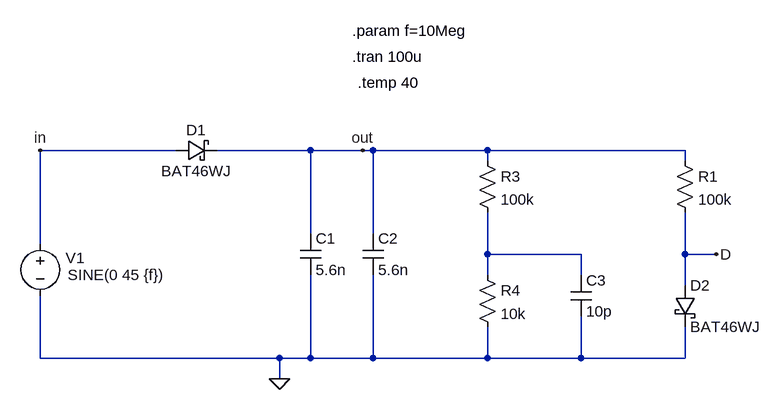
[diagram p0: schematic peak_detector_diode_comp.asc]
peak_detector_diode_comp.asc, the LTspice schematic file:
Version 4
SHEET 1 1120 680
WIRE 96 48 -112 48
WIRE 304 48 160 48
WIRE 384 48 304 48
WIRE 400 48 384 48
WIRE 576 48 400 48
WIRE 880 48 576 48
WIRE 576 64 576 48
WIRE 880 64 880 48
WIRE 304 176 304 48
WIRE 400 176 400 48
WIRE -112 192 -112 48
WIRE 576 208 576 144
WIRE 720 208 576 208
WIRE 880 208 880 144
WIRE 928 208 880 208
WIRE 576 240 576 208
WIRE 720 240 720 208
WIRE 880 256 880 208
WIRE -112 368 -112 272
WIRE 256 368 -112 368
WIRE 304 368 304 240
WIRE 304 368 256 368
WIRE 400 368 400 240
WIRE 400 368 304 368
WIRE 576 368 576 320
WIRE 576 368 400 368
WIRE 720 368 720 304
WIRE 720 368 576 368
WIRE 880 368 880 320
WIRE 880 368 720 368
WIRE 256 400 256 368
FLAG 384 48 out
FLAG -112 48 in
FLAG 256 400 0
FLAG 928 208 D
SYMBOL cap 288 176 R0
SYMATTR InstName C1
SYMATTR Value 5.6n
SYMBOL schottky 96 64 R270
WINDOW 0 32 32 VTop 2
WINDOW 3 0 32 VBottom 2
SYMATTR InstName D1
SYMATTR Value BAT46WJ
SYMATTR Description Diode
SYMATTR Type diode
SYMBOL voltage -112 176 R0
WINDOW 3 42 64 Left 2
WINDOW 123 24 124 Left 2
WINDOW 39 0 0 Left 0
WINDOW 0 39 38 Left 2
SYMATTR Value SINE(0 45 {f})
SYMATTR InstName V1
SYMBOL cap 384 176 R0
SYMATTR InstName C2
SYMATTR Value 5.6n
SYMBOL res 560 48 R0
SYMATTR InstName R3
SYMATTR Value 100k
SYMBOL res 560 224 R0
SYMATTR InstName R4
SYMATTR Value 10k
SYMBOL cap 704 240 R0
SYMATTR InstName C3
SYMATTR Value 10p
SYMBOL res 864 48 R0
SYMATTR InstName R1
SYMATTR Value 100k
SYMBOL schottky 864 256 R0
SYMATTR InstName D2
SYMATTR Value BAT46WJ
SYMATTR Description Diode
SYMATTR Type diode
TEXT 368 -136 Left 2 !.param f=10Meg
TEXT 368 -96 Left 2 !.tran 100u
TEXT 376 -56 Left 2 !.temp 40

The netlist it stands for:
* peak_detector_diode_comp.asc
C1 out 0 5.6n
D1 in out BAT46WJ
V1 in 0 SINE(0 45 {f})
C2 out 0 5.6n
R3 out N001 100k
R4 N001 0 10k
C3 N001 0 10p
R1 out D 100k
D2 D 0 BAT46WJ
.model D D
.lib standard.dio
.param f=10Meg
.tran 100u
.temp 40
.backanno
.end